# Altium project Grounded clock.PrjPcb (part 1 of 2)
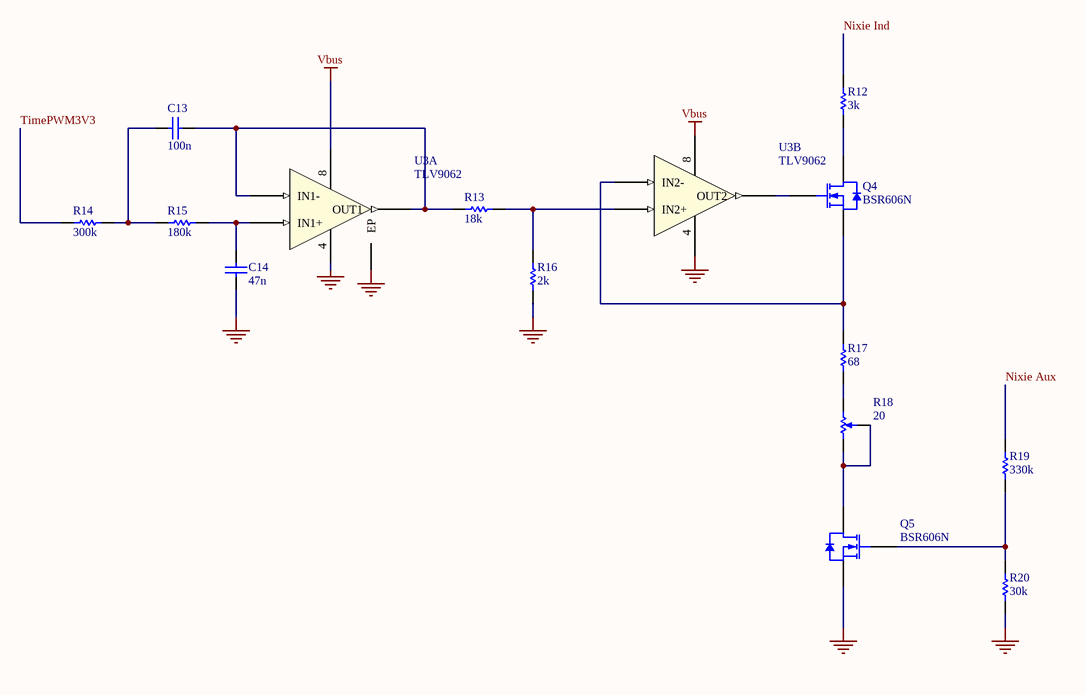
[diagram p0: Driver.SchDoc]
4 sheets, 72 parts. Net scope: global (net labels, ports and power ports of the same name join across sheets).
Board file: Board.PcbDoc
Sheets:
  Driver.SchDoc
  MCU.SchDoc
  Board connectors.SchDoc
  Power supply.SchDoc

## Sheet Driver.SchDoc
size A

### Parts
C13  100n  [CAPC0402(1005)60_N]
C14  47n  [CAPC0402(1005)60_N]
Q4  BSR606N  [INF-PG-SC59_N]
Q5  BSR606N  [INF-PG-SC59_N]
R12  3k  [RESC0402(1005)_N]
R13  18k  [RESC0402(1005)_N]
R14  300k  [RESC0402(1005)_N]
R15  180k  [RESC0402(1005)_N]
R16  2k  [RESC0402(1005)_N]
R17  68  [RESC0402(1005)_N]
R18  20  [PVG3A]
R19  330k  [RESC0402(1005)_N]
R20  30k  [RESC0402(1005)_N]
U3  TLV9062  [WSON-8]  (parts A,B of 2)

### Nets
GND: C14.1 Q5.2(SOURCE) R16.1 R20.1 U3.4(V-) U3.9(EP)
Vbus: U3.8(V+)
Nixie Aux: R19.2
Nixie Ind: R12.2
TimePWM3V3: R14.1
NetC13_1: C13.1 R14.2 R15.1
NetC13_2: C13.2 R13.1 U3.1(OUT1) U3.2(IN1-)
NetC14_2: C14.2 R15.2 U3.3(IN1+)
NetQ4_1: Q4.1(GATE) U3.7(OUT2)
NetQ4_2: Q4.2(SOURCE) R17.2 U3.6(IN2-)
NetQ4_3: Q4.3(DRAIN) R12.1
NetQ5_1: Q5.1(GATE) R19.1 R20.2
NetQ5_3: Q5.3(DRAIN) R18.1 R18.2
NetR13_2: R13.2 R16.2 U3.5(IN2+)
NetR17_1: R17.1 R18.3

### Library data of the parts
C13 = AC0402KRX7R7BB104: CAP CER 0.1UF 16V X7R 0402; Manufacturer: Yageo; Tolerance: ±10%; Supplier 1: Digi-Key; Manufacturer Part Number: AC0402KRX7R7BB104; RoHS: RoHS Compliant; Category: Capacitors; Stock 1: 29133; Pricing 1: 1=0.1, 10=0.068, 100=0.0304, 500=0.02174, 1000=0.01708, 2500=0.01553, 5000=0.01429 (USD); Packaging: Cut Tape (CT); Part Status: Active; Voltage - Rated: 16V; Temperature Coefficient: X7R; Operating Temperature: -55°C ~ 125°C; Features: -; Ratings: AEC-Q200; Applications: Automotive; Failure Rate: -; Mounting Type: Surface Mount, MLCC; Package / Case: 0402 (1005 Metric); Size / Dimension: 0.039" L x 0.020" W (1.00mm x 0.50mm); Height - Seated (Max): -; Thickness (Max): 0.022" (0.55mm); Lead Spacing: -; Lead Style: -; ComponentLink1URL: http://www.yageo.com/documents/recent/UPY-AC_NP0X7R_16V-to-630V_11.pdf; ComponentLink1Description: http://www.yageo.com/documents/recent/UPY-AC_NP0X7R_16V-to-630V_11.pdf; Supplier Part Number 1: 311-3026-1-ND
C14 = AC0402KRX7R7BB473: CAP CER 0.047UF 16V X7R 0402; Manufacturer: Yageo; Tolerance: ±10%; Supplier 1: Digi-Key; Manufacturer Part Number: AC0402KRX7R7BB473; RoHS: RoHS Compliant; Category: Capacitors; Stock 1: 7700; Pricing 1: 1=0.13, 10=0.093, 100=0.0416, 500=0.0297, 1000=0.02334, 2500=0.02122, 5000=0.01952 (USD); Packaging: Cut Tape (CT); Part Status: Active; Voltage - Rated: 16V; Temperature Coefficient: X7R; Operating Temperature: -55°C ~ 125°C; Features: -; Ratings: AEC-Q200; Applications: Automotive; Failure Rate: -; Mounting Type: Surface Mount, MLCC; Package / Case: 0402 (1005 Metric); Size / Dimension: 0.039" L x 0.020" W (1.00mm x 0.50mm); Height - Seated (Max): -; Thickness (Max): 0.022" (0.55mm); Lead Spacing: -; Lead Style: -; ComponentLink1URL: http://www.yageo.com/documents/recent/UPY-AC_NP0X7R_16V-to-630V_11.pdf; ComponentLink1Description: http://www.yageo.com/documents/recent/UPY-AC_NP0X7R_16V-to-630V_11.pdf; Supplier Part Number 1: 311-3064-1-ND
Q4 Q5 = BSR606N: N-Channel OptiMOS(TM)-3 Small-Signal-Transistor, 60 V VDS, 2.3 A ID, -55 to 150 degC, PG-SC59, Reel, Green; Manufacturer: Infineon; Manufacturer Part Number: BSR606NH6327XTSA1; ID (max): 2.3Â A; IDpuls (max): 9.1Â A; RthJA (max): 250Â K/W; VDS (max): 60Â V; Green: TRUE; Polarity: FALSE; Ptot (max): 0.5Â W; VGS(th) (min): 1.3Â V; QG: 3.7Â nC; VGS(th) (max): 2.3Â V; Mode: Enhancement; Continuous Drain Current (ID): 2.3A; Drain to Source Voltage (Vdss): 60V; Drain to Source Resistance: 60mR; Max Power Dissipation: 500mW; Input Capacitance: 657pF; Number of Elements: 1; Threshold Voltage: 1.8V; Element Configuration: Single; Gate to Source Voltage (Vgs): 20V; ComponentLink2URL: http://www.infineon.com/dgdl/BSR606N_2+3.pdf?folderId=db3a3043156fd573011622e10b5c1f67&fileId=db3a30433e78ea82013e7ea9a659062b; PackageDescription: 3-Pin Semiconductor Package, 3 x 1.53 mm Body, 0.95 mm Pitch; ComponentLink1Description: Manufacturer URL; PackageVersion: Mar-08; Packing: Reel; PartNumber: BSR606N; DatasheetVersion: Rev. 2.3; ComponentLink1URL: http://www.infineon.com/; ComponentLink2Description: Datasheet; ComponentLink3Description: Package Specification; Mounting: SMD; Mounting Technology: Surface Mount; PackageReference: PG-SC59; ComponentLink3URL: http://www.infineon.com/dgdl/SC59-Package_Overview.pdf?folderId=db3a30431936bc4b01194dc0d34440b0&fileId=db3a30431936bc4b01194dd1aa1d40cf; Halogen-free: TRUE; Supplier 1: Digi-Key; Stock 1: 131; Pricing 1: 1=0.61, 10=0.517, 100=0.3875, 500=0.28416, 1000=0.21958 (USD); Mount: Surface Mount; Case/Package: SC; Number of Pins: 59; Min Operating Temperature: -55°C; Max Operating Temperature: 150°C; Packaging: Tape and Reel; Package Quantity: 3000; Rds On Max: 60mR; Power Dissipation: 500mW; Max Dual Supply Voltage: 60V; REACH SVHC: No SVHC; Lead Free: Lead Free; Halogen Free: Halogen Free; Supplier Part Number 1: BSR606NH6327XTSA1CT-ND
R12 = RC0402FR-073KL: RES SMD 3K OHM 1% 1/16W 0402; Manufacturer: Yageo; Power (Watts): 0.063W, 1/16W; Temperature Coefficient: ±100ppm/°C; Supplier 1: Digi-Key; Manufacturer Part Number: RC0402FR-073KL; RoHS: RoHS Compliant; Category: Resistors; Stock 1: 3701800; Pricing 1: 1=0.1, 10=0.018, 100=0.0076, 1000=0.00356, 2500=0.00313, 5000=0.00263 (USD); Packaging: Cut Tape (CT); Part Status: Active; Tolerance: ±1%; Composition: Thick Film; Features: Moisture Resistant; Operating Temperature: -55°C ~ 155°C; Package / Case: 0402 (1005 Metric); Supplier Device Package: 0402; Size / Dimension: 0.039" L x 0.020" W (1.00mm x 0.50mm); Height - Seated (Max): 0.016" (0.40mm); Failure Rate: -; ComponentLink1URL: http://www.yageo.com/documents/recent/PYu-RC_Group_51_RoHS_L_9.pdf; ComponentLink1Description: http://www.yageo.com/documents/recent/PYu-RC_Group_51_RoHS_L_9.pdf; Supplier Part Number 1: 311-3KLRCT-ND
R13 = RC0402FR-0718KL: RES SMD 18K OHM 1% 1/16W 0402; Manufacturer: Yageo; Power (Watts): 0.063W, 1/16W; Temperature Coefficient: ±100ppm/°C; Supplier 1: Digi-Key; Manufacturer Part Number: RC0402FR-0718KL; RoHS: RoHS Compliant; Category: Resistors; Stock 1: 0; Pricing 1: 1=0.1, 10=0.018, 100=0.0076, 1000=0.00356, 2500=0.00313, 5000=0.00263 (USD); Packaging: Cut Tape (CT); Part Status: Active; Tolerance: ±1%; Composition: Thick Film; Features: Moisture Resistant; Operating Temperature: -55°C ~ 155°C; Package / Case: 0402 (1005 Metric); Supplier Device Package: 0402; Size / Dimension: 0.039" L x 0.020" W (1.00mm x 0.50mm); Height - Seated (Max): 0.016" (0.40mm); Failure Rate: -; ComponentLink1URL: http://www.yageo.com/documents/recent/PYu-RC_Group_51_RoHS_L_9.pdf; ComponentLink1Description: http://www.yageo.com/documents/recent/PYu-RC_Group_51_RoHS_L_9.pdf; Supplier Part Number 1: 311-18.0KLRCT-ND
R14 = RC0402FR-07300KL: RES SMD 300K OHM 1% 1/16W 0402; Manufacturer: Yageo; Power (Watts): 0.063W, 1/16W; Temperature Coefficient: ±100ppm/°C; Supplier 1: Digi-Key; Manufacturer Part Number: RC0402FR-07300KL; RoHS: RoHS Compliant; Category: Resistors; Stock 1: 1397022; Pricing 1: 1=0.1, 10=0.018, 100=0.0076, 1000=0.00356, 2500=0.00313, 5000=0.00263 (USD); Packaging: Cut Tape (CT); Part Status: Active; Tolerance: ±1%; Composition: Thick Film; Features: Moisture Resistant; Operating Temperature: -55°C ~ 155°C; Package / Case: 0402 (1005 Metric); Supplier Device Package: 0402; Size / Dimension: 0.039" L x 0.020" W (1.00mm x 0.50mm); Height - Seated (Max): 0.016" (0.40mm); Failure Rate: -; ComponentLink1URL: http://www.yageo.com/documents/recent/PYu-RC_Group_51_RoHS_L_9.pdf; ComponentLink1Description: http://www.yageo.com/documents/recent/PYu-RC_Group_51_RoHS_L_9.pdf; Supplier Part Number 1: 311-300KLRCT-ND
R15 = RC0402FR-07180KL: RES SMD 180K OHM 1% 1/16W 0402; Manufacturer: Yageo; Power (Watts): 0.063W, 1/16W; Temperature Coefficient: ±100ppm/°C; Supplier 1: Digi-Key; Manufacturer Part Number: RC0402FR-07180KL; RoHS: RoHS Compliant; Category: Resistors; Stock 1: 0; Pricing 1: 1=0.1, 10=0.018, 100=0.0076, 1000=0.00356, 2500=0.00313, 5000=0.00263 (USD); Packaging: Cut Tape (CT); Part Status: Active; Tolerance: ±1%; Composition: Thick Film; Features: Moisture Resistant; Operating Temperature: -55°C ~ 155°C; Package / Case: 0402 (1005 Metric); Supplier Device Package: 0402; Size / Dimension: 0.039" L x 0.020" W (1.00mm x 0.50mm); Height - Seated (Max): 0.016" (0.40mm); Failure Rate: -; ComponentLink1URL: http://www.yageo.com/documents/recent/PYu-RC_Group_51_RoHS_L_9.pdf; ComponentLink1Description: http://www.yageo.com/documents/recent/PYu-RC_Group_51_RoHS_L_9.pdf; Supplier Part Number 1: 311-180KLRCT-ND
R16 = RC0402FR-072KL: RES SMD 2K OHM 1% 1/16W 0402; Manufacturer: Yageo; Power (Watts): 0.063W, 1/16W; Temperature Coefficient: ±100ppm/°C; Supplier 1: Digi-Key; Manufacturer Part Number: RC0402FR-072KL; RoHS: RoHS Compliant; Category: Resistors; Stock 1: 8929494; Pricing 1: 1=0.1, 10=0.018, 100=0.0076, 1000=0.00356, 2500=0.00313, 5000=0.00263 (USD); Packaging: Cut Tape (CT); Part Status: Active; Tolerance: ±1%; Composition: Thick Film; Features: Moisture Resistant; Operating Temperature: -55°C ~ 155°C; Package / Case: 0402 (1005 Metric); Supplier Device Package: 0402; Size / Dimension: 0.039" L x 0.020" W (1.00mm x 0.50mm); Height - Seated (Max): 0.016" (0.40mm); Failure Rate: -; ComponentLink1URL: http://www.yageo.com/documents/recent/PYu-RC_Group_51_RoHS_L_9.pdf; ComponentLink1Description: http://www.yageo.com/documents/recent/PYu-RC_Group_51_RoHS_L_9.pdf; Supplier Part Number 1: 311-2KLRCT-ND
R17 = RC0402FR-0768RL: RES SMD 68 OHM 1% 1/16W 0402; Manufacturer: Yageo; Power (Watts): 0.063W, 1/16W; Temperature Coefficient: ±100ppm/°C; Supplier 1: Digi-Key; Manufacturer Part Number: RC0402FR-0768RL; RoHS: RoHS Compliant; Category: Resistors; Stock 1: 0; Pricing 1: 1=0.1, 10=0.018, 100=0.0073, 1000=0.00329, 2500=0.00286, 5000=0.00236 (USD); Packaging: Cut Tape (CT); Part Status: Active; Tolerance: ±1%; Composition: Thick Film; Features: Moisture Resistant; Operating Temperature: -55°C ~ 155°C; Package / Case: 0402 (1005 Metric); Supplier Device Package: 0402; Size / Dimension: 0.039" L x 0.020" W (1.00mm x 0.50mm); Height - Seated (Max): 0.016" (0.40mm); Failure Rate: -; ComponentLink1URL: http://www.yageo.com/documents/recent/PYu-RC_Group_51_RoHS_L_9.pdf; ComponentLink1Description: http://www.yageo.com/documents/recent/PYu-RC_Group_51_RoHS_L_9.pdf; Supplier Part Number 1: 311-68.0LRCT-ND
R18 = PVG3A200C01R00: TRIMMER 20 OHM 0.25W J LEAD TOP; Manufacturer: Bourns Inc.; Power (Watts): 0.25W, 1/4W; Tolerance: ±20%; Temperature Coefficient: ±150ppm/°C; Adjustment Type: Top Adjustment; Resistive Material: Cermet; Supplier 1: Digi-Key; Manufacturer Part Number: PVG3A200C01R00; RoHS: RoHS Compliant; Category: Potentiometers, Variable Resistors; Stock 1: 42863; Pricing 1: 1=1.57, 10=1.386, 25=1.2476, 50=1.2012, 100=1.155, 250=1.08572, 500=0.924 (USD); Packaging: Cut Tape (CT); Part Status: Active; Mounting Type: Surface Mount; Termination Style: J Lead; Size / Dimension: Rectangular - 0.142" x 0.134" Face x 0.079" H (3.60mm x 3.40mm x 2.00mm); ComponentLink1URL: https://www.bourns.com/docs/Product-Datasheets/pvg3.pdf; ComponentLink1Description: https://www.bourns.com/docs/Product-Datasheets/pvg3.pdf; Supplier Part Number 1: 490-2647-1-ND
R19 = RC0402FR-07330KL: RES SMD 330K OHM 1% 1/16W 0402; Manufacturer: Yageo; Power (Watts): 0.063W, 1/16W; Temperature Coefficient: ±100ppm/°C; Supplier 1: Digi-Key; Manufacturer Part Number: RC0402FR-07330KL; RoHS: RoHS Compliant; Category: Resistors; Stock 1: 1954423; Pricing 1: 1=0.1, 10=0.018, 100=0.0076, 1000=0.00356, 2500=0.00313, 5000=0.00263 (USD); Packaging: Cut Tape (CT); Part Status: Active; Tolerance: ±1%; Composition: Thick Film; Features: Moisture Resistant; Operating Temperature: -55°C ~ 155°C; Package / Case: 0402 (1005 Metric); Supplier Device Package: 0402; Size / Dimension: 0.039" L x 0.020" W (1.00mm x 0.50mm); Height - Seated (Max): 0.016" (0.40mm); Failure Rate: -; ComponentLink1URL: http://www.yageo.com/documents/recent/PYu-RC_Group_51_RoHS_L_9.pdf; ComponentLink1Description: http://www.yageo.com/documents/recent/PYu-RC_Group_51_RoHS_L_9.pdf; Supplier Part Number 1: 311-330KLRCT-ND
R20 = RC0402FR-0730KL: RES SMD 30K OHM 1% 1/16W 0402; Manufacturer: Yageo; Power (Watts): 0.063W, 1/16W; Temperature Coefficient: ±100ppm/°C; Supplier 1: Digi-Key; Manufacturer Part Number: RC0402FR-0730KL; RoHS: RoHS Compliant; Category: Resistors; Stock 1: 3148260; Pricing 1: 1=0.1, 10=0.018, 100=0.0076, 1000=0.00356, 2500=0.00313, 5000=0.00263 (USD); Packaging: Cut Tape (CT); Part Status: Active; Tolerance: ±1%; Composition: Thick Film; Features: Moisture Resistant; Operating Temperature: -55°C ~ 155°C; Package / Case: 0402 (1005 Metric); Supplier Device Package: 0402; Size / Dimension: 0.039" L x 0.020" W (1.00mm x 0.50mm); Height - Seated (Max): 0.016" (0.40mm); Failure Rate: -; ComponentLink1URL: http://www.yageo.com/documents/recent/PYu-RC_Group_51_RoHS_L_9.pdf; ComponentLink1Description: http://www.yageo.com/documents/recent/PYu-RC_Group_51_RoHS_L_9.pdf; Supplier Part Number 1: 311-30.0KLRCT-ND
U3 = TLV9062IDSGR: CMOS Amplifier 2 Circuit Rail-to-Rail 8-WSON (2x2); Manufacturer: Texas Instruments; Slew Rate: 6.5 V/µs; Current - Supply: 538µA; Voltage - Supply, Single/Dual (±): 1.8 V ~ 5.5 V; Supplier 1: Digi-Key; Manufacturer Part Number: TLV9062IDSGR; RoHS: RoHS Compliant; Category: Integrated Circuits (ICs); Stock 1: 2198; Pricing 1: 1=0.65, 10=0.556, 100=0.4153, 500=0.3263, 1000=0.25214 (USD); Packaging: Cut Tape (CT); Part Status: Active; Amplifier Type: CMOS; Output Type: Rail-to-Rail; Operating Temperature: -40°C ~ 125°C (TA); Mounting Type: Surface Mount; Package / Case: 8-WFDFN Exposed Pad; Supplier Device Package: 8-WSON (2x2); ComponentLink1URL: http://www.ti.com/lit/ds/symlink/tlv9062.pdf; ComponentLink1Description: http://www.ti.com/lit/ds/symlink/tlv9062.pdf; Supplier Part Number 1: 296-50013-1-ND

## Sheet MCU.SchDoc
size A
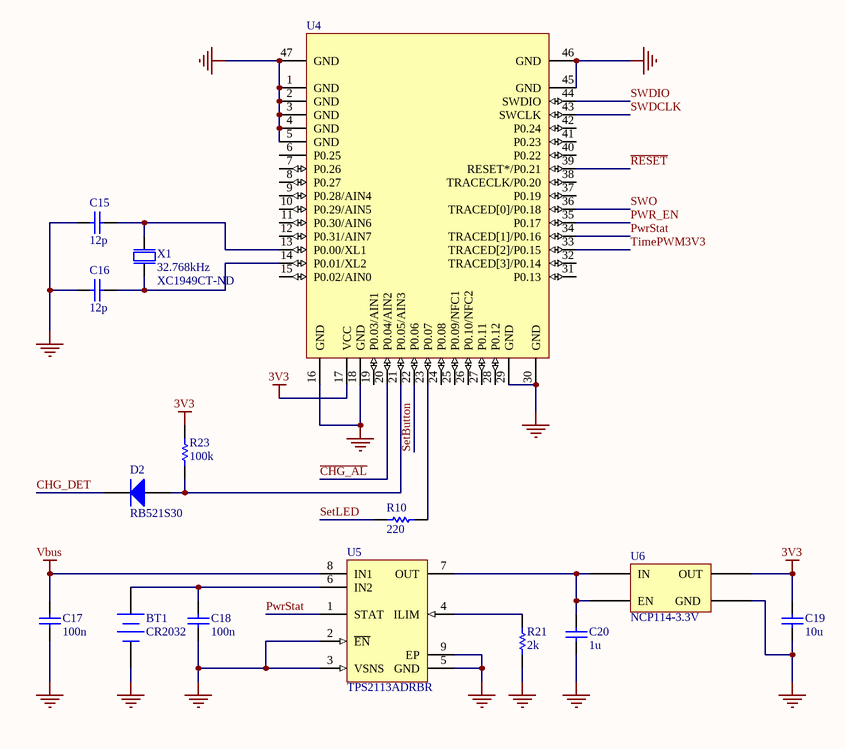
[diagram p1: MCU.SchDoc]

### Parts
BT1  CR2032  [BK-912]
C15  12p  [CAPC0402(1005)60_N]
C16  12p  [CAPC0402(1005)60_N]
C17  100n  [CAPC0402(1005)33_N]
C18  100n  [CAPC0402(1005)33_N]
C19  10u  [CAPC0603(1608)100_N]
C20  1u  [CAPC0603(1608)100_N]
D2  RB521S30  [SOD-523]
R10  220  [RESC0402(1005)_N]
R21  2k  [RESC0402(1005)_N]
R23  100k  [RESC0402(1005)_N]
U4  BMD-300  [BMD-300]  (value not drawn)
U5  TPS2113ADRBR  [VSON-8]
U6  NCP114-3.3V  [TSOP-5]
X1  32.768kHz  Supplier Part Number 1: XC1949CT-ND  [3215 XTAL]

### Nets
3V3: C19.2 R23.2 U4.17(VCC) U6.5(OUT)
GND: BT1.2(-) C15.1 C16.1 C17.1 C18.1 C19.1 C20.1 R21.1 U4.1(GND) U4.2(GND) U4.3(GND) U4.4(GND) U4.5(GND) U4.16(GND) U4.18(GND) U4.29(GND) U4.30(GND) U4.45(GND) U4.46(GND) U4.47(GND) U5.2(~{EN}) U5.3(VSNS) U5.5(GND) U5.9(EP) U6.2(GND)
Vbus: C17.2 U5.8(IN1)
~{CHG_AL}: U4.20(P0.04/AIN2)
CHG_DET: D2.1(K)
PWR_EN: U4.35(P0.17)
PwrStat: U4.34(TRACED[1]/P0.16) U5.1(STAT)
~{RESET}: U4.39(RESET*/P0.21)
SetButton: U4.22(P0.06)
SetLED: R10.1
SWDCLK: U4.43(SWCLK)
SWDIO: U4.44(SWDIO)
SWO: U4.36(TRACED[0]/P0.18)
TimePWM3V3: U4.33(TRACED[2]/P0.15)
NetBT1_1: BT1.1(+) C18.2 U5.6(IN2)
NetC15_2: C15.2 U4.13(P0.00/XL1) X1.2
NetC16_2: C16.2 U4.14(P0.01/XL2) X1.1
NetC20_2: C20.2 U5.7(OUT) U6.1(IN) U6.3(EN)
NetD2_2: D2.2(A) R23.1 U4.21(P0.05/AIN3)
NetR10_2: R10.2 U4.23(P0.07)
NetR21_2: R21.2 U5.4(ILIM)

Not connected (* = marked no-connect by the designer): U4 6(P0.25) 7(P0.26) 8(P0.27) 9(P0.28/AIN4) 10(P0.29/AIN5) 11(P0.30/AIN6) 12(P0.31/AIN7) 15(P0.02/AIN0) 19(P0.03/AIN1) 24(P0.08) 25(P0.09/NFC1) 26(P0.10/NFC2) 27(P0.11) 28(P0.12) 31(P0.13) 32(TRACED[3]/P0.14) 37(P0.19) 38(TRACECLK/P0.20) 40(P0.22) 41(P0.23) 42(P0.24)

### Library data of the parts
BT1 = BK-912: BATTERY RETAINER COIN 20MM SMD; Manufacturer: Memory Protection Devices; Manufacturer Part Number: BK-912-TR; Number of Cells: 1; Supplier 1: Digi-Key; Stock 1: 39032; Pricing 1: 1=0.73, 10=0.661, 100=0.5138 (USD); Mount: PCB,Surface Mount; Case/Package: SMD/SMT; Package Quantity: 700; Termination: SMD/SMT; ComponentLink1URL: https://media.digikey.com/pdf/Data%20Sheets/Memory%20Protection%20PDFs/Coin_Cell_Guide.pdf; ComponentLink1Description: https://media.digikey.com/pdf/Data%20Sheets/Memory%20Protection%20PDFs/Coin_Cell_Guide.pdf; Supplier Part Number 1: BK-912-CT-ND
C15 C16 = CC0402FRNPO9BN120: CAP CER 12PF 50V C0G/NPO 0402; Manufacturer: Yageo; Tolerance: ±1%; Temperature Coefficient: C0G, NP0; Notification: Current market demand for these product types have resulted in fluctuating and extending lead times. Lead times may differ.; Supplier 1: Digi-Key; Manufacturer Part Number: CC0402FRNPO9BN120; RoHS: RoHS Compliant; Category: Capacitors; Stock 1: 100000; Pricing 1: 1=0.14, 10=0.104, 100=0.0464, 500=0.03312, 1000=0.02603, 2500=0.02366, 5000=0.02177 (USD); Packaging: Cut Tape (CT); Part Status: Active; Voltage - Rated: 50V; Operating Temperature: -55°C ~ 125°C; Features: -; Ratings: -; Applications: General Purpose; Failure Rate: -; Mounting Type: Surface Mount, MLCC; Package / Case: 0402 (1005 Metric); Size / Dimension: 0.039" L x 0.020" W (1.00mm x 0.50mm); Height - Seated (Max): -; Thickness (Max): 0.022" (0.55mm); Lead Spacing: -; Lead Style: -; ComponentLink1URL: http://www.yageo.com/documents/recent/UPY-GP_NP0_16V-to-50V_16.pdf; ComponentLink1Description: http://www.yageo.com/documents/recent/UPY-GP_NP0_16V-to-50V_16.pdf; Supplier Part Number 1: 311-1641-1-ND
C17 C18 = CC0402KRX7R8BB104: CAP CER 0.1UF 25V X7R 0402; Manufacturer: Yageo; Tolerance: ±10%; Notification: Current market demand for these product types have resulted in fluctuating and extending lead times. Lead times may differ.; Supplier 1: Digi-Key; Manufacturer Part Number: CC0402KRX7R8BB104; RoHS: RoHS Compliant; Category: Capacitors; Stock 1: 0; Pricing 1: 1=0.1, 10=0.048, 100=0.0215, 500=0.01534, 1000=0.01205, 2500=0.01095, 5000=0.01007 (USD); Packaging: Cut Tape (CT); Part Status: Active; Voltage - Rated: 25V; Temperature Coefficient: X7R; Operating Temperature: -55°C ~ 125°C; Features: -; Ratings: -; Applications: General Purpose; Failure Rate: -; Mounting Type: Surface Mount, MLCC; Package / Case: 0402 (1005 Metric); Size / Dimension: 0.039" L x 0.020" W (1.00mm x 0.50mm); Height - Seated (Max): -; Thickness (Max): 0.022" (0.55mm); Lead Spacing: -; Lead Style: -; ComponentLink1URL: http://www.yageo.com/documents/recent/UPY-GPHC_X7R_6.3V-to-50V_18.pdf; ComponentLink1Description: http://www.yageo.com/documents/recent/UPY-GPHC_X7R_6.3V-to-50V_18.pdf; Supplier Part Number 1: 311-2077-1-ND; Supplier 2: Mouser; Supplier Part Number 2: 603-CC402KRX7R8BB104
C19 = GRM188R61C106KAALD: Multilayer Ceramic Capacitors MLCC - SMD/SMT 0603 10uF 16volts X5R 10%; Manufacturer: Murata; Voltage Rating: 16V; Supplier 1: Digi-Key; Manufacturer Part Number: GRM188R61C106KAALD; Stock 1: 0; Pricing 1: 1=0.49, 10=0.339, 100=0.2036, 500=0.15266, 1000=0.12892 (USD); Mount: Surface Mount; Case/Package: 0603; Weight: 0.000222oz; Case Code (Metric): 1608; Case Code (Imperial): 0603; Min Operating Temperature: -55°C; Max Operating Temperature: 85°C; Capacitance: 10uF; Packaging: Tape and Reel; Dielectric: X5R; Tolerance: 10%; Termination: SMD/SMT; Composition: Ceramic; Voltage Rating (DC): 16V; Package Quantity: 4000; Length: 0.063inch; Height: 0.8mm; Width: 0.8mm; Thickness: 0.037inch; REACH SVHC: No SVHC; Lead Free: Lead Free; Supplier Part Number 1: 490-10728-1-ND
C20 = CL10B105MO8NNWC: CAP CER 1UF 16V X7R 0603; Manufacturer: Samsung Electro-Mechanics; Tolerance: ±20%; Notification: Current market demand for these product types have resulted in fluctuating and extending lead times. Lead times may differ.; Supplier 1: Digi-Key; Manufacturer Part Number: CL10B105MO8NNWC; RoHS: RoHS Compliant; Category: Capacitors; Stock 1: 40000; Pricing 1: 1=0.1, 10=0.043, 100=0.0194, 500=0.01406, 1000=0.01121 (USD); Packaging: Cut Tape (CT); Part Status: Active; Voltage - Rated: 16V; Temperature Coefficient: X7R; Operating Temperature: -55°C ~ 125°C; Features: -; Ratings: -; Applications: General Purpose; Mounting Type: Surface Mount, MLCC; Package / Case: 0603 (1608 Metric); Size / Dimension: 0.063" L x 0.031" W (1.60mm x 0.80mm); Height - Seated (Max): -; Thickness (Max): 0.035" (0.90mm); Lead Spacing: -; Lead Style: -; ComponentLink1URL: http://www.samsungsem.com/kr/support/product-search/mlcc/CL10B105MO8NNWC.jsp; ComponentLink1Description: http://www.samsungsem.com/kr/support/product-search/mlcc/CL10B105MO8NNWC.jsp; Supplier Part Number 1: 1276-6524-1-ND
D2 = RB521S30: DIODE SCHOTTKY 30V 200MA SOD523F; Manufacturer: ON Semiconductor / Fairchild; Forward Voltage: 500mV; Element Configuration: Single; Max Reverse Leakage Current: 30uA; Power Dissipation: 200mW; Supplier 1: Digi-Key; Manufacturer Part Number: RB521S30; Stock 1: 44826; Pricing 1: 1=0.23, 10=0.191, 100=0.1011, 500=0.0665, 1000=0.04522 (USD); Mount: Surface Mount; Number of Pins: 2; Weight: 0.01g; Min Operating Temperature: -55°C; Max Operating Temperature: 125°C; Packaging: Tape and Reel; Forward Current: 200mA; Max Repetitive Reverse Voltage (Vrrm): 30V; Package Quantity: 1; Average Rectified Current: 200mA; Peak Reverse Current: 30uA; Max Reverse Voltage (DC): 30V; Length: 1.3mm; Height: 0.7mm; Width: 0.9mm; Radiation Hardening: No; REACH SVHC: No SVHC; Lead Free: Lead Free; ComponentLink1URL: http://www.fairchildsemi.com/ds/RB/RB521S30.pdf; ComponentLink1Description: http://www.fairchildsemi.com/ds/RB/RB521S30.pdf; ComponentLink2URL: https://www.fairchildsemi.com/datasheets/RB/RB521S30.pdf; ComponentLink2Description: https://www.fairchildsemi.com/datasheets/RB/RB521S30.pdf; ComponentLink3URL: https://www.verical.com/server-webapp/html/getDatasheet?partID=71229; ComponentLink3Description: https://www.verical.com/server-webapp/html/getDatasheet?partID=71229; Supplier Part Number 1: RB521S30CT-ND
R10 = RC0402FR-07220RL: RES SMD 220 OHM 1% 1/16W 0402; Manufacturer: Yageo; Resistance: 220R; Power Rating: 62.5mW; Voltage Rating: 50V; Temperature Coefficient: 100ppm/°C; Max Power Dissipation: 63mW; Supplier 1: Digi-Key; Manufacturer Part Number: RC0402FR-07220RL; Stock 1: 5150470; Pricing 1: 1=0.1, 10=0.018, 100=0.0073, 1000=0.00329, 2500=0.00286, 5000=0.00236 (USD); Case/Package: 0402; Number of Pins: 2; Case Code (Imperial): 0402; Case Code (Metric): 1005; Min Operating Temperature: -55°C; Max Operating Temperature: 155°C; Tolerance: 1%; Packaging: Tape and Reel; Voltage Rating (DC): 50V; Termination: SMD/SMT; Composition: Thick Film; Military Standard: Not; Package Quantity: 1; Number of Terminations: 2; Features: Moisture Resistant; Length: 1mm; Height: 0.016inch; Width: 0.02inch; Depth: 0.5mm; REACH SVHC: No SVHC; Lead Free: Lead Free; ComponentLink1URL: http://www.yageo.com/documents/recent/PYu-RC_Group_51_RoHS_L_9.pdf; ComponentLink1Description: http://www.yageo.com/documents/recent/PYu-RC_Group_51_RoHS_L_9.pdf; ComponentLink2URL: http://documents.rs-components.com/techlib://itc_doclist_GB.htm?stockno=6186324; ComponentLink2Description: http://documents.rs-components.com/techlib://itc_doclist_GB.htm?stockno=6186324; ComponentLink3URL: http://www.yageo.com/documents/recent/PYu-RC0402_51_RoHS_L_6_r.pdf; ComponentLink3Description: http://www.yageo.com/documents/recent/PYu-RC0402_51_RoHS_L_6_r.pdf; Supplier Part Number 1: 311-220LRCT-ND
R21 = RC0402FR-072KL: as R16 on sheet Driver; Supplier 1: Digi-Key; Manufacturer Part Number: RC0402FR-072KL; RoHS: RoHS Compliant; Category: Resistors; Stock 1: 8929494; Pricing 1: 1=0.1, 10=0.018, 100=0.0076, 1000=0.00356, 2500=0.00313, 5000=0.00263 (USD); Packaging: Cut Tape (CT); Part Status: Active; Tolerance: ±1%; Composition: Thick Film; Features: Moisture Resistant; Operating Temperature: -55°C ~ 155°C; Package / Case: 0402 (1005 Metric); Supplier Device Package: 0402; Size / Dimension: 0.039" L x 0.020" W (1.00mm x 0.50mm); Height - Seated (Max): 0.016" (0.40mm); Failure Rate: -; ComponentLink1URL: http://www.yageo.com/documents/recent/PYu-RC_Group_51_RoHS_L_9.pdf; ComponentLink1Description: http://www.yageo.com/documents/recent/PYu-RC_Group_51_RoHS_L_9.pdf; Supplier Part Number 1: 311-2KLRCT-ND
R23 = RC0402FR-07100KL: RES SMD 100K OHM 1% 1/16W 0402; Manufacturer: Yageo; Power (Watts): 0.063W, 1/16W; Temperature Coefficient: ±100ppm/°C; Supplier 1: Digi-Key; Manufacturer Part Number: RC0402FR-07100KL; RoHS: RoHS Compliant; Category: Resistors; Stock 1: 20396473; Pricing 1: 1=0.1, 10=0.018, 100=0.0076, 1000=0.00356, 2500=0.00313, 5000=0.00263 (USD); Packaging: Cut Tape (CT); Part Status: Active; Tolerance: ±1%; Composition: Thick Film; Features: Moisture Resistant; Operating Temperature: -55°C ~ 155°C; Package / Case: 0402 (1005 Metric); Supplier Device Package: 0402; Size / Dimension: 0.039" L x 0.020" W (1.00mm x 0.50mm); Height - Seated (Max): 0.016" (0.40mm); Failure Rate: -; ComponentLink1URL: http://www.yageo.com/documents/recent/PYu-RC_Group_51_RoHS_L_9.pdf; ComponentLink1Description: http://www.yageo.com/documents/recent/PYu-RC_Group_51_RoHS_L_9.pdf; Supplier Part Number 1: 311-100KLRCT-ND
U4 = BMD-300-A: Bluetooth 4.2 LE Module, nRF52832, 512kB Flash, 64kB RAM; Manufacturer: Rigado; Manufacturer P/N: BMD-300-A-R; Internal Antenna: Yes; Protocol: BLE 4.2; RF Freq: 2.4GHz; Added By: Cam N; Data Rate: 2Mbps; Sensitivity: -96dBm; Interface: I2C,SPI,UART; Current - Receiving: 10.4mA; Current - Transmitting: 17mA; Part Number: BMD-300-A; Size: 14mm x 9.8mm; Height: 1.9mm; Added Date: 10/14/2015; Manufacturer Part Number: BMD-300-A-R; Mount: Surface Mount; Case/Package: Module; Min Operating Temperature: -40°C; Max Operating Temperature: 85°C; Packaging: Tape and Reel; Frequency: 2.4GHz; Memory Size: 64KB; Supplier 1: Digi-Key; Supplier Part Number 1: 1604-1006-1-ND
U5 = TPS2113ADRB: Dual In / Single Out Autoswitching Power Mux, 2.8 to 5.5 V, -40 to 85 degC, 9-pin SON (DRB), Green (RoHS & no Sb/Br); Manufacturer: Texas Instruments; IN1, IN2 Input Voltage(Min)(V): 2.8; SubFamily: Power Multiplexer (MUX); IN1 rDS(on)(Typ)(mOhm): 84; IN2 rDS(on)(Typ)(Ohms): 0.084; Number of Inputs: 2; IN1, IN2 Input Voltage(Max)(V): 5.5; IN2 Output Current(Max)(A): 1.25; Operating Supply Voltage: 5.5V; Number of Outputs: 1; Output Current: 1.25A; Min Input Voltage: 2.8V; Turn-On Delay Time: 1ms; PackageVersion: revK, Jun-2012; PackageDescription: 8-Pin Plastic Small Outline No-Lead, 3 x 3 x 1 mm Body, 0.65 mm Pitch, Exposed Pad; ComponentLink1Description: Datasheet; ComponentLink1URL: http://www.ti.com/general/docs/lit/getliterature.tsp?genericPartNumber=TPS2113A&fileType=pdf; DatasheetVersion: SBVS045C; Eco-Plan: Green (RoHS & no Sb/Br); PartNumber: TPS2113ADRBR; Mounting Technology: Surface Mount; PackageReference: DRB0008B; IN1 Output Current(Max)(A): 1.25; Supplier 1: Digi-Key; Manufacturer Part Number: TPS2113ADRBR; Stock 1: 8863; Pricing 1: 1=2.01, 10=1.801, 100=1.448, 500=1.18966, 1000=0.98571 (USD); Case/Package: TSSOP; Number of Pins: 8; Min Operating Temperature: -40°C; Max Operating Temperature: 85°C; Package Quantity: 3000; Packaging: Tape and Reel; Max Output Current: 1.25A; Max Input Voltage: 5.5V; Current - Output 2: 1.25A; Radiation Hardening: No; Lead Free: Lead Free; ComponentLink2URL: http://www.ti.com/general/docs/lit/getliterature.tsp?genericPartNumber=TPS2113A&&fileType=pdf; ComponentLink2Description: http://www.ti.com/general/docs/lit/getliterature.tsp?genericPartNumber=TPS2113A&&fileType=pdf; ComponentLink3URL: https://www.verical.com/server-webapp/html/getDatasheet?partID=627486; ComponentLink3Description: https://www.verical.com/server-webapp/html/getDatasheet?partID=627486; ComponentLink4URL: http://www.ti.com/lit/ds/symlink/tps2113a.pdf; ComponentLink4Description: http://www.ti.com/lit/ds/symlink/tps2113a.pdf; Supplier Part Number 1: 296-46373-1-ND
U6 = NCP114ASN330T1G: IC REG LINEAR 3.3V 300MA 5TSOP; Manufacturer: ON Semiconductor; Supplier 1: Digi-Key; Supplier Part Number 1: NCP114ASN330T1GOSCT-ND; Manufacturer Part Number: NCP114ASN330T1G; Stock 1: 16190; Pricing 1: 1=0.35, 10=0.264, 100=0.1493, 500=0.09888, 1000=0.07581 (USD); Output Current: 300mA; Lead Free: Lead Free; Supplier 2: Mouser; Supplier Part Number 2: 863-NCP114ASN330T1G
X1 = ECS-.327-9-34B-C-TR: CRYSTAL 32.7680KHZ 9PF SMD; Manufacturer: ECS International; Frequency Tolerance: 10ppm; ESR (Equivalent Series Resistance): 70kR; Supplier 1: Digi-Key; Manufacturer Part Number: ECS-.327-9-34B-C-TR; Mount: Surface Mount; Case/Package: SMD/SMT; Number of Pins: 2; Min Operating Temperature: -40°C; Max Operating Temperature: 85°C; Load Capacitance: 9pF; Package Quantity: 3000; Packaging: Tape and Reel; Frequency: 32.768kHz; Termination: SMD/SMT; Frequency Stability: 10ppm; Length: 0.126inch; Height: 0.035inch; Width: 0.061inch; Lead Pitch: 2.4mm; ComponentLink1URL: http://www.ecsxtal.com/store/pdf/ecx-31b.pdf; ComponentLink1Description: http://www.ecsxtal.com/store/pdf/ecx-31b.pdf; Stock 1: 17736; Pricing 1: 1=0.81, 10=0.712, 50=0.666, 100=0.5886, 500=0.55758, 1000=0.46466 (USD)

## Sheet Board connectors.SchDoc
size A
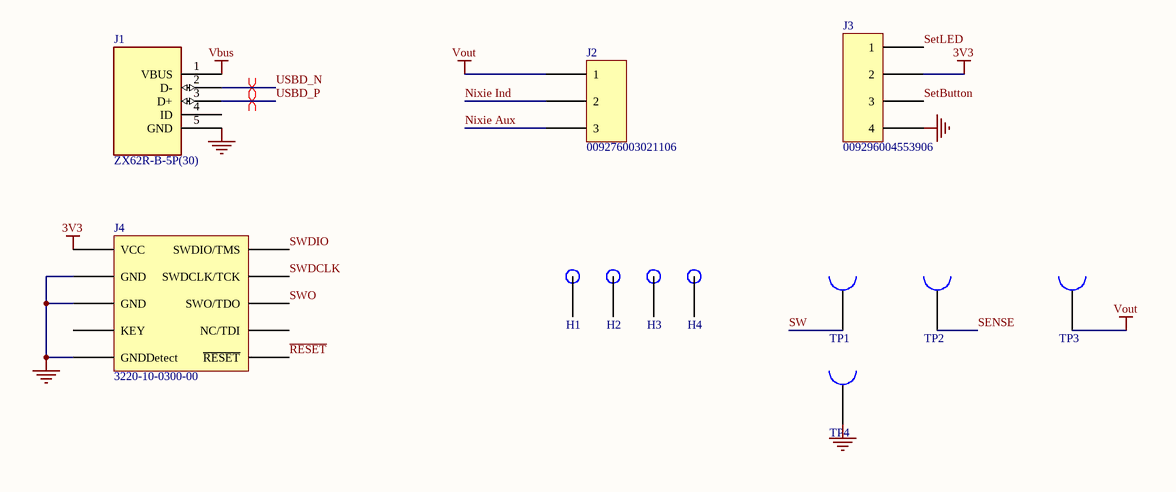
[diagram p2: Board connectors.SchDoc]

### Parts
H1  M3 PLATED TIGHT FIT PAN HEAD  [M3 PLATED TIGHT PAN HEAD]  (value not drawn)  (no BOM)
H2  M3 PLATED TIGHT FIT PAN HEAD  [M3 PLATED TIGHT PAN HEAD]  (value not drawn)  (no BOM)
H3  M3 PLATED TIGHT FIT PAN HEAD  [M3 PLATED TIGHT PAN HEAD]  (value not drawn)  (no BOM)
H4  M3 PLATED TIGHT FIT PAN HEAD  [M3 PLATED TIGHT PAN HEAD]  (value not drawn)  (no BOM)
J1  ZX62R-B-5P(30)  [HRS_ZX62R-B-5P(30)_ZX62R-B-5P(30)(Primary)]
J2  009276003021106  [009276003021106]
J3  009296004553906  [009296004553906]
J4  3220-10-0300-00  [3220-10-0300-00]
TP1  SMD test point  [2mm SMD test point]  (value not drawn)  (no BOM)
TP2  SMD test point  [2mm SMD test point]  (value not drawn)  (no BOM)
TP3  SMD test point  [2mm SMD test point]  (value not drawn)  (no BOM)
TP4  SMD test point  [2mm SMD test point]  (value not drawn)  (no BOM)

### Nets
3V3: J3.2 J4.1(VCC)
GND: J1.5(GND) J3.4 J4.3(GND) J4.5(GND) J4.9(GNDDetect) TP4.1
Vbus: J1.1(VBUS)
Vout: J2.1 TP3.1
Nixie Aux: J2.3
Nixie Ind: J2.2
~{RESET}: J4.10(~{RESET})
SENSE: TP2.1
SetButton: J3.3
SetLED: J3.1
SW: TP1.1
SWDCLK: J4.4(SWDCLK/TCK)
SWDIO: J4.2(SWDIO/TMS)
SWO: J4.6(SWO/TDO)
USBD_N: J1.2(D-)
USBD_P: J1.3(D+)

Not connected (* = marked no-connect by the designer): H1 1; H2 1; H3 1; H4 1; J1 4(ID); J4 7(KEY) 8(NC/TDI)

### Layout directives
differential pair: USBD_N, USBD_P

### Library data of the parts
H1-H4 = M3 PLATED TIGHT FIT PAN HEAD: M3 x 0.5mm plated tight fit pan head
J1 = ZX62R-B-5P(30): HIROSE(HRS)         ZX62R-B-5P(30)             USB Connector, Micro USB Type B, USB 2.0, Receptacle, 5 Ways, Surface Mount, Right Angle; Number of Contacts: 5; USB Standard: USB 2.0; Supplier 1: Digi-Key; Manufacturer: Hirose; Manufacturer Part Number: ZX62R-B-5P(30); Stock 1: 50674; Pricing 1: 1=1.02, 10=0.898, 25=0.8448, 50=0.8096, 100=0.7744, 250=0.704, 500=0.6336, 1000=0.5632 (USD); Mount: Horizontal,Surface Mount; Contact Material: Copper Alloy; Contact Plating: Gold; Packaging: Tape and Reel; Connector Type: USB; Gender: Receptacle; Orientation: Right Angle; REACH SVHC: Unknown; Lead Free: Lead Free; Supplier Part Number 1: H125274CT-ND
J2 = 009276003021106: CONN TERM BLOCK 3 POS WTB; Manufacturer: Kyocera; Number of Contacts: 3; Voltage Rating: 250V; Current: 6A; Number of Levels: 1; Gender: Receptacle; Pitch: 2.5mm; Wire Gauge (Max): 24AWG; Wire Gauge (Min): 18AWG; Supplier 1: Digi-Key; Manufacturer Part Number: 009276003021106; Stock 1: 0; Mount: Surface Mount,Through Hole; Housing Colour: White; Contact Material: Copper,Copper Alloy; Contact Plating: Tin; Housing Material: Nylon; Colour: White; Min Operating Temperature: -40°C; Max Operating Temperature: 125°C; Number of Rows: 1; Termination: Solder; Orientation: Right Angle; Packaging: Tape and Reel; Package Quantity: 1; Number of Positions: 3; Voltage: 250V; Number of Positions Per Level: 3; Number of Circuits: 3; Max Supply Voltage (AC): 250V; Max Voltage Rating (AC): 250V; Length: 9mm; Height: 5mm; Depth: 9mm; Width: 7.5mm; Radiation Hardening: No; REACH SVHC: No SVHC; Lead Free: Lead Free; ComponentLink1URL: https://media.digikey.com/pdf/Data%20Sheets/AVX%20PDFs/00927600x021x06_Spec.PDF; ComponentLink1Description: https://media.digikey.com/pdf/Data%20Sheets/AVX%20PDFs/00927600x021x06_Spec.PDF; ComponentLink2URL: http://www.farnell.com/datasheets/2003050.pdf; ComponentLink2Description: http://www.farnell.com/datasheets/2003050.pdf; ComponentLink3URL: http://www.avx.com/docs/Catalogs/9276.pdf; ComponentLink3Description: http://www.avx.com/docs/Catalogs/9276.pdf; ComponentLink4URL: //media.digikey.com/pdf/Data%20Sheets/AVX%20PDFs/00927600x021x06_Spec.PDF; ComponentLink4Description: //media.digikey.com/pdf/Data%20Sheets/AVX%20PDFs/00927600x021x06_Spec.PDF; Supplier Part Number 1: 478-6170-1-ND
J3 = 009296004553906: Headers & Wire Housings 4WAY POKE HOME VERTICAL TOP MOUNT; Manufacturer: Kyocera AVX; Voltage Rating: 200V; Current Rating: 7A; Number of Positions: 4; Connector Type: Poke-In; Wire Gauge (Max): 26AWG; Wire Gauge (Min): 18AWG; Pitch: 4mm; Cable Pitch: 0.157inch; Supplier 1: Digi-Key; Manufacturer Part Number: 009296004553906; Stock 1: 2302; Pricing 1: 1=1.2, 10=1.057, 100=0.9123 (USD); Mount: Surface Mount; Colour: White; Contact Material: Copper Alloy; Contact Plating: Tin; Housing Material: Nylon; Min Operating Temperature: -40°C; Max Operating Temperature: 125°C; Packaging: Tape and Reel; Package Quantity: 400; Termination: SMD/SMT; Number of Rows: 1; Contact Gender: Female; Wire/Cable Gauge: 18AWG; Lead Free: Lead Free; Flammability Rating: UL94 V-0; ComponentLink1URL: http://datasheets.avx.com/PokeHomeVerticalTop_00-9296.pdf; ComponentLink1Description: http://datasheets.avx.com/PokeHomeVerticalTop_00-9296.pdf; Supplier Part Number 1: 478-9323-1-ND
J4 = 3220-10-0300-00: IDC BOX HEADER 0.050 10 POS; Manufacturer: CNC Tech; Number of Positions: 10; Connector Type: Male Pin; Pitch: 0.05inch; Supplier 1: Digi-Key; Manufacturer Part Number: 3220-10-0300-00; Stock 1: 193314; Pricing 1: 1=0.74, 10=0.69, 100=0.529, 500=0.46, 3200=0.345, 6400=0.3335, 12800=0.3059 (USD); Mount: Surface Mount; Contact Plating: Gold; Package Quantity: 3200; Number of Rows: 2; Packaging: Tray; Termination: Solder; Row Spacing: 0.05inch; ComponentLink1URL: http://cnctech.us/idcmatching2.pdf; ComponentLink1Description: http://cnctech.us/idcmatching2.pdf; Supplier Part Number 1: 1175-1629-ND